# Altium schematic sheet FPGA_51_I2C_ADC_DAC.SchDoc
size B; Organization: Altium Limited; Address1: L3, 12a Rodborough Rd; Address2: Frenchs Forest; Address3: NSW; Address4: Australia 2086; DocumentNumber: 1; SheetNumber: 1; SheetTotal: 1
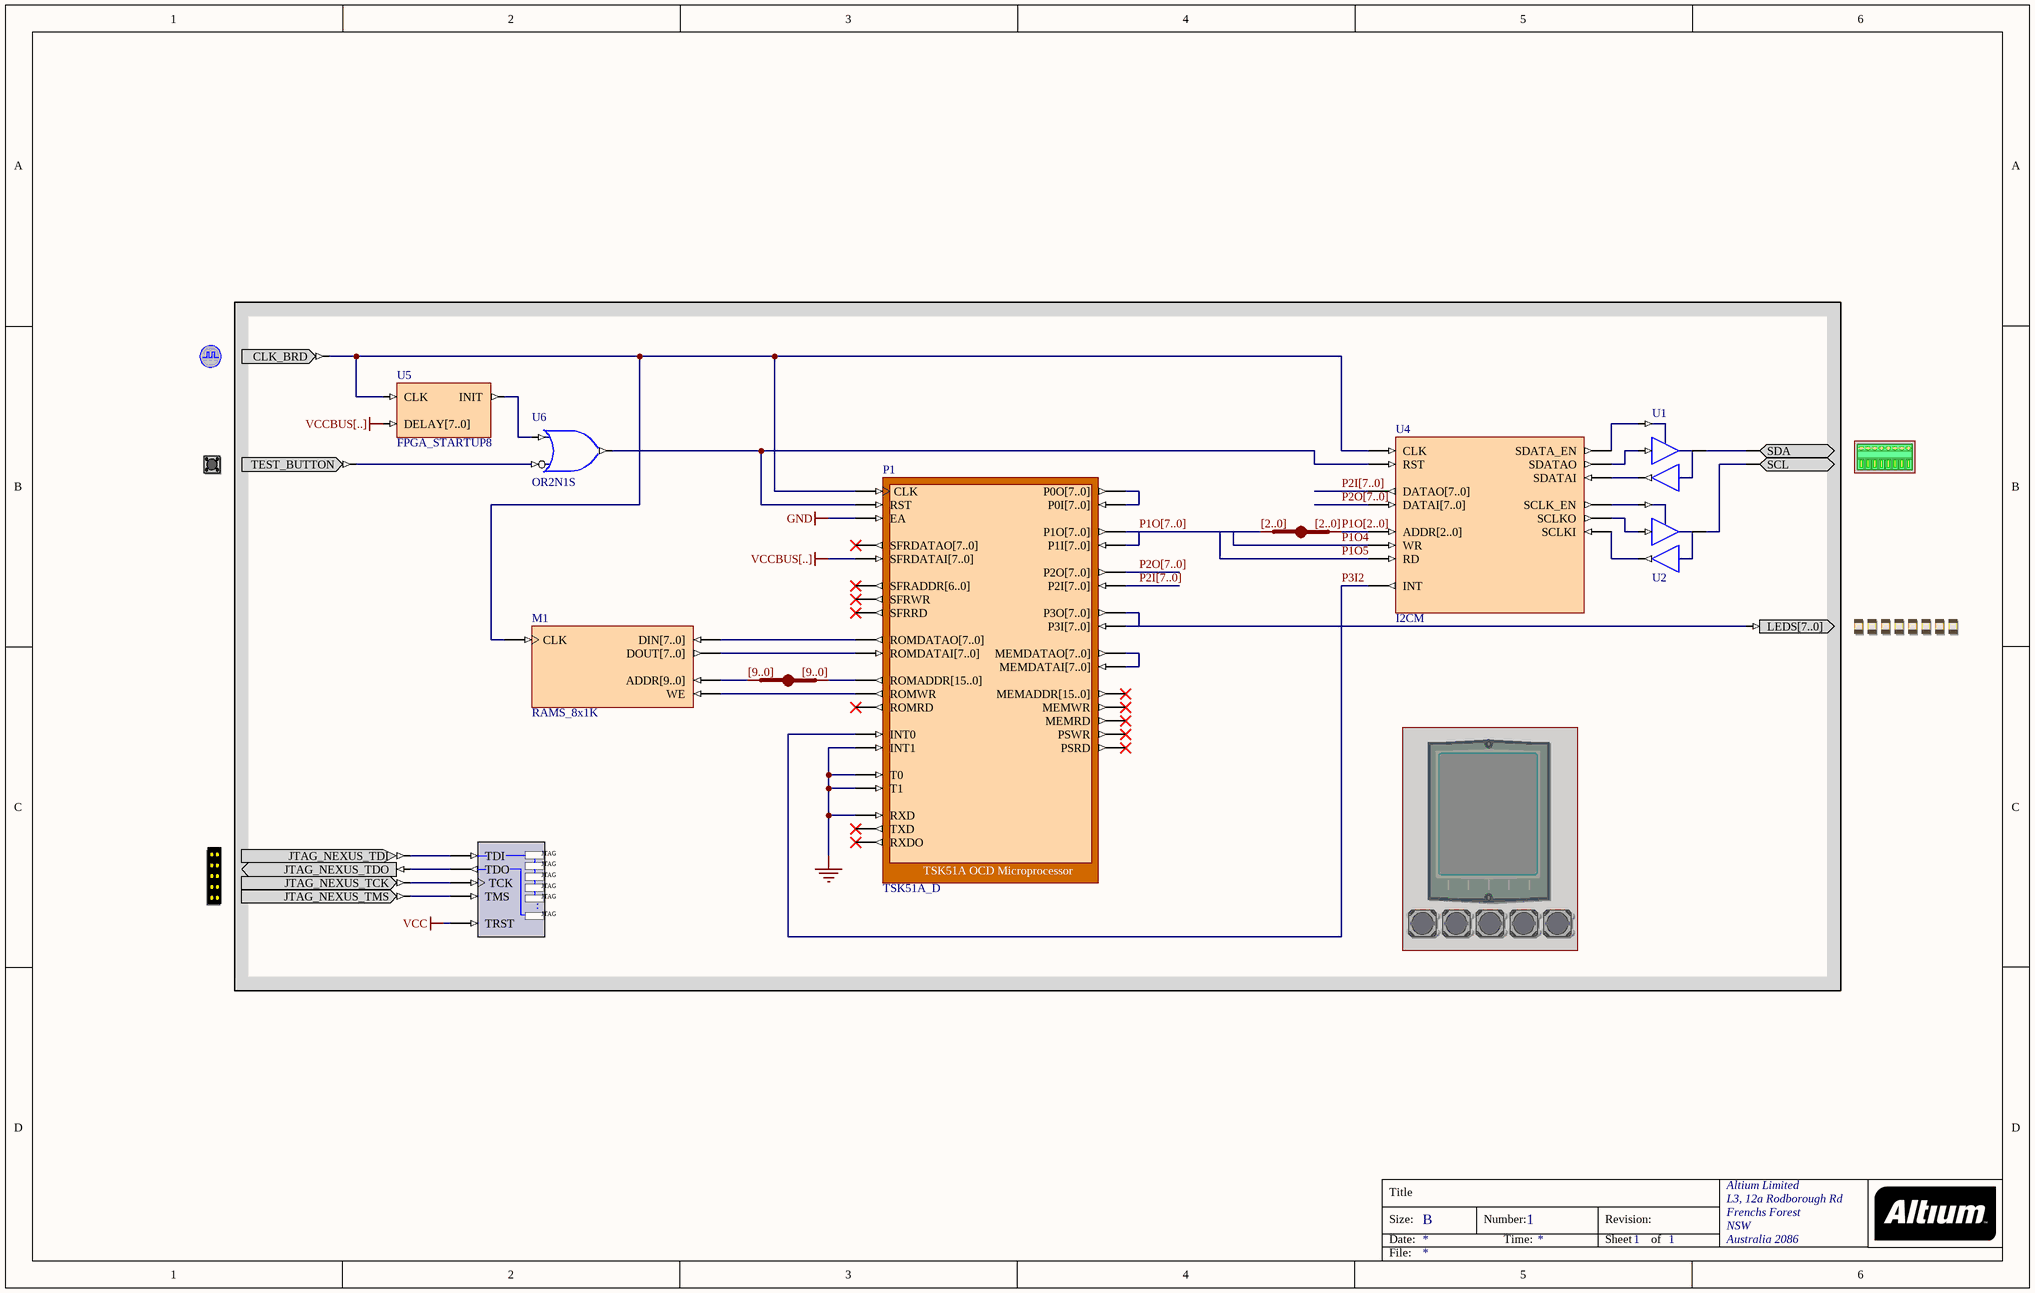
[diagram p0: FPGA_51_I2C_ADC_DAC.SchDoc]

## Parts
(Parts that share a designator on the sheet are numbered #1, #2 ... from top to bottom, then left to right.)
?#1  CLOCK_BOARD  (value not drawn)
?#2  ADCDAC_I2C  (value not drawn)
?#3  TEST_BUTTON  (value not drawn)
?#4  LED  (value not drawn)
?#5  FIRMWARE_TFT_ENABLE  (value not drawn)  (masked out: inside a compile mask, not in the netlist)
?#6  NEXUS_JTAG_CONNECTOR  (value not drawn)
?#7  FIRMWARE_BUTTONS_ENABLE  (value not drawn)  (masked out: inside a compile mask, not in the netlist)
M1  RAMS_8x1K
NEXUS_JTAG_PORT  NEXUS_JTAG_PORT  (value not drawn)
P1  TSK51A_D
U1  IOBUF  (value not drawn)
U2  IOBUF  (value not drawn)
U4  I2CM
U5  FPGA_STARTUP8
U6#1  OR2N1S
U6#2  IndexA: [2..0]  (hidden comment: JB)
U7  IndexA: [9..0]  (hidden comment: JB)

## Nets
GND: P1.EA P1.INT1 P1.RXD P1.T0 P1.T1
VCC: NEXUS_JTAG_PORT.TRST
VCCBUS[..]: P1.SFRDATAI[7..0] U5.DELAY[7..0]
P1O4: U4.WR
P1O5: U4.RD
P1O[2..0]: U4.ADDR[2..0] U6#2.B[0..0]
P1O[7..0]: P1.P1I[7..0] P1.P1O[7..0] U6#2.A[0..0]
P2I[7..0]: P1.P2I[7..0] U4.DATAO[7..0]
P2O[7..0]: P1.P2O[7..0] U4.DATAI[7..0]
P3I2: P1.INT0 U4.INT
Net?#1_CLK_BRD: ?#1.CLK_BRD M1.CLK P1.CLK U4.CLK U5.CLK
Net?#2_SCL: ?#2.SCL U2.IO
Net?#2_SDA: ?#2.SDA U1.IO
Net?#3_TEST_BUTTON: ?#3.TEST_BUTTON U6#1.I0
Net?#4_LEDS[7..0]: ?#4.LEDS[7..0] P1.P3I[7..0] P1.P3O[7..0]
Net?#6_JTAG_NEXUS_TCK: ?#6.JTAG_NEXUS_TCK NEXUS_JTAG_PORT.TCK
Net?#6_JTAG_NEXUS_TDI: ?#6.JTAG_NEXUS_TDI NEXUS_JTAG_PORT.TDI
Net?#6_JTAG_NEXUS_TDO: ?#6.JTAG_NEXUS_TDO NEXUS_JTAG_PORT.TDO
Net?#6_JTAG_NEXUS_TMS: ?#6.JTAG_NEXUS_TMS NEXUS_JTAG_PORT.TMS
NetM1_ADDR[9..0]: M1.ADDR[9..0] U7.B[0..0]
NetM1_DIN[7..0]: M1.DIN[7..0] P1.ROMDATAO[7..0]
NetM1_DOUT[7..0]: M1.DOUT[7..0] P1.ROMDATAI[7..0]
NetM1_WE: M1.WE P1.ROMWR
NetP1_MEMDATAI[7..0]: P1.MEMDATAI[7..0] P1.MEMDATAO[7..0]
NetP1_P0I[7..0]: P1.P0I[7..0] P1.P0O[7..0]
NetP1_ROMADDR[15..0]: P1.ROMADDR[15..0] U7.A[0..0]
NetP1_RST: P1.RST U4.RST U6#1.O
NetU1_I: U1.I U4.SDATAO
NetU1_O: U1.O U4.SDATAI
NetU1_T: U1.T U4.SDATA_EN
NetU2_I: U2.I U4.SCLKO
NetU2_O: U2.O U4.SCLKI
NetU2_T: U2.T U4.SCLK_EN
NetU5_INIT: U5.INIT U6#1.I1

Not connected (* = marked no-connect by the designer): P1 MEMADDR[15..0]* MEMRD* MEMWR* PSRD* PSWR* ROMRD* RXDO* SFRADDR[6..0]* SFRDATAO[7..0]* SFRRD* SFRWR* TXD*

## Buses and harness runs
bus P1O[2..0]
bus P1O[7..0]
bus P2I[7..0]
bus P2O[7..0]

## Notes on the sheet
- Title
- Size:
- Date:
- B
- Number:
- Time:
- Revision:
- Sheet
- of
- File:
- (in symbol NEXUS_JTAG_PORT) JTAG; .

## Library data of the parts
?#1 = CLOCK_BOARD: Global System Clock Supply; PortComponent: True; Published: 19-Nov-2003; Publisher: Altium Limited; HelpURL: TR0143 Technical Reference Manual for Altium's Desktop NanoBoard NB2DSK01.pdf#page=41; UseInDSF: True
?#2 = ADCDAC_I2C: Analog Digital/ Digital Analog Converter, I2C Interface; PortComponent: True; Published: 19-Nov-2003; Publisher: Altium Limited; HelpURL: TR0143 Technical Reference Manual for Altium's Desktop NanoBoard NB2DSK01.pdf#page=48; UseInDSF: True
?#3 = TEST_BUTTON: Test / Reset Button; PortComponent: True; Published: 19-Nov-2003; Publisher: Altium Limited; HelpURL: TR0143 Technical Reference Manual for Altium's Desktop NanoBoard NB2DSK01.pdf#page=53
?#4 = LED: Bank of eight Red LEDs; PortComponent: True; Published: 19-Nov-2003; Publisher: Altium Limited; HelpURL: TR0143 Technical Reference Manual for Altium's Desktop NanoBoard NB2DSK01.pdf#page=51
?#5 = FIRMWARE_TFT_ENABLE: TFT LCD Panel; PortComponent: True; Published: 22-Jan-2007; Publisher: Altium Limited; HelpURL: TR0143 Technical Reference Manual for Altium's Desktop NanoBoard NB2DSK01.pdf#page=50
?#6 = NEXUS_JTAG_CONNECTOR: JTAG Port; PortComponent: True; Published: 19-Nov-2003; Publisher: Altium Limited; HelpURL: TR0102 NanoBoard Technical Reference Manual - NB1.pdf#page=33
?#7 = FIRMWARE_BUTTONS_ENABLE: Generic User Buttons; PortComponent: True; Published: 16-Apr-2007; Publisher: Altium Limited; HelpURL: TR0143 Technical Reference Manual for Altium's Desktop NanoBoard NB2DSK01.pdf#page=53
M1 = RAMS_8x1K: Single Port Random Access Memory; Memory_Depth: 1024; Memory_Type: RAM_SinglePortBlock; Memory_Width: 8; Memory_ClockEdge: Rising; Nexus_Core: Memory_Program; Published: 13/01/2004; Publisher: Altium Hobart Technology Center
NEXUS_JTAG_PORT = NEXUS_JTAG_PORT: Soft Nexus-Chain Connector; NEXUS_JTAG_CONNECTOR: True; Published: 18-Dec-2003; Publisher: Altium Limited
P1 = TSK51A_D: TSK51A OCD Microprocessor; NEXUS_CORE: Processor_OCDS; NEXUS_JTAG_DEVICE: True; NEXUS_JTAG_ORDER: 0; ChildModel1: RAM256x8_TSK51D; ChildCore1: M1; ChildModel2: RAM256x8_TSK51D_prim0; Published: 17-Nov-2004; Publisher: Altium Limited; ComponentLink1Description: Core &Resource Usage; ComponentLink1URL: CR0140 FPGA Processor Resource Usage.pdf#page=9; HelpURL: CR0115 TSK51x MCU.pdf; LastRevisionNo: 1.00.00; ComponentLink2Description: Embedded &Tools Guide; ComponentLink2URL: GU0107 Using the TSK51x TSK52x Embedded Tools.pdf; ComponentLink3Description: Embedded T&echnical References; ComponentLink3URL: TR0105 TSK51x TSK52x Embedded Tools Reference.pdf
U1 U2 = IOBUF: Input/Output Buffer; ArchiveName: GENERIC; Published: 18-Nov-2003; Publisher: Altium Limited; Xilinx Equivalent: IOBUF; Core Revision: 1.00.00
U4 = I2CM: I2C Master; Published: 7/01/2004; Publisher: Altium Hobart Technology Centre; Core Revision: 1.00.00
U5 = FPGA_STARTUP8: FPGA Startup With 8 Bit Delay; Published: 21/01/2004; Publisher: Altium Hobart Technology Centre; Core Revision: 1.00.00
U6#1 = OR2N1S: 2-Input OR Gate with Active Low A Input, Single Pin Version; Xilinx Equivalent: OR2B1; ArchiveName: GENERIC; Published: 18-Dec-2003; Publisher: Altium Limited; Core Revision: 1.00.00
U6#2 U7 = JB: System BUS Joiner; ArchiveName: GENERIC; Published: 18-Dec-2003; Publisher: Altium Limited; Core Revision: 1.00.00
  U6#2: IndexB: [2..0]
  U7: IndexB: [9..0]